# Altium schematic sheet 主控板.SchDoc
size A3
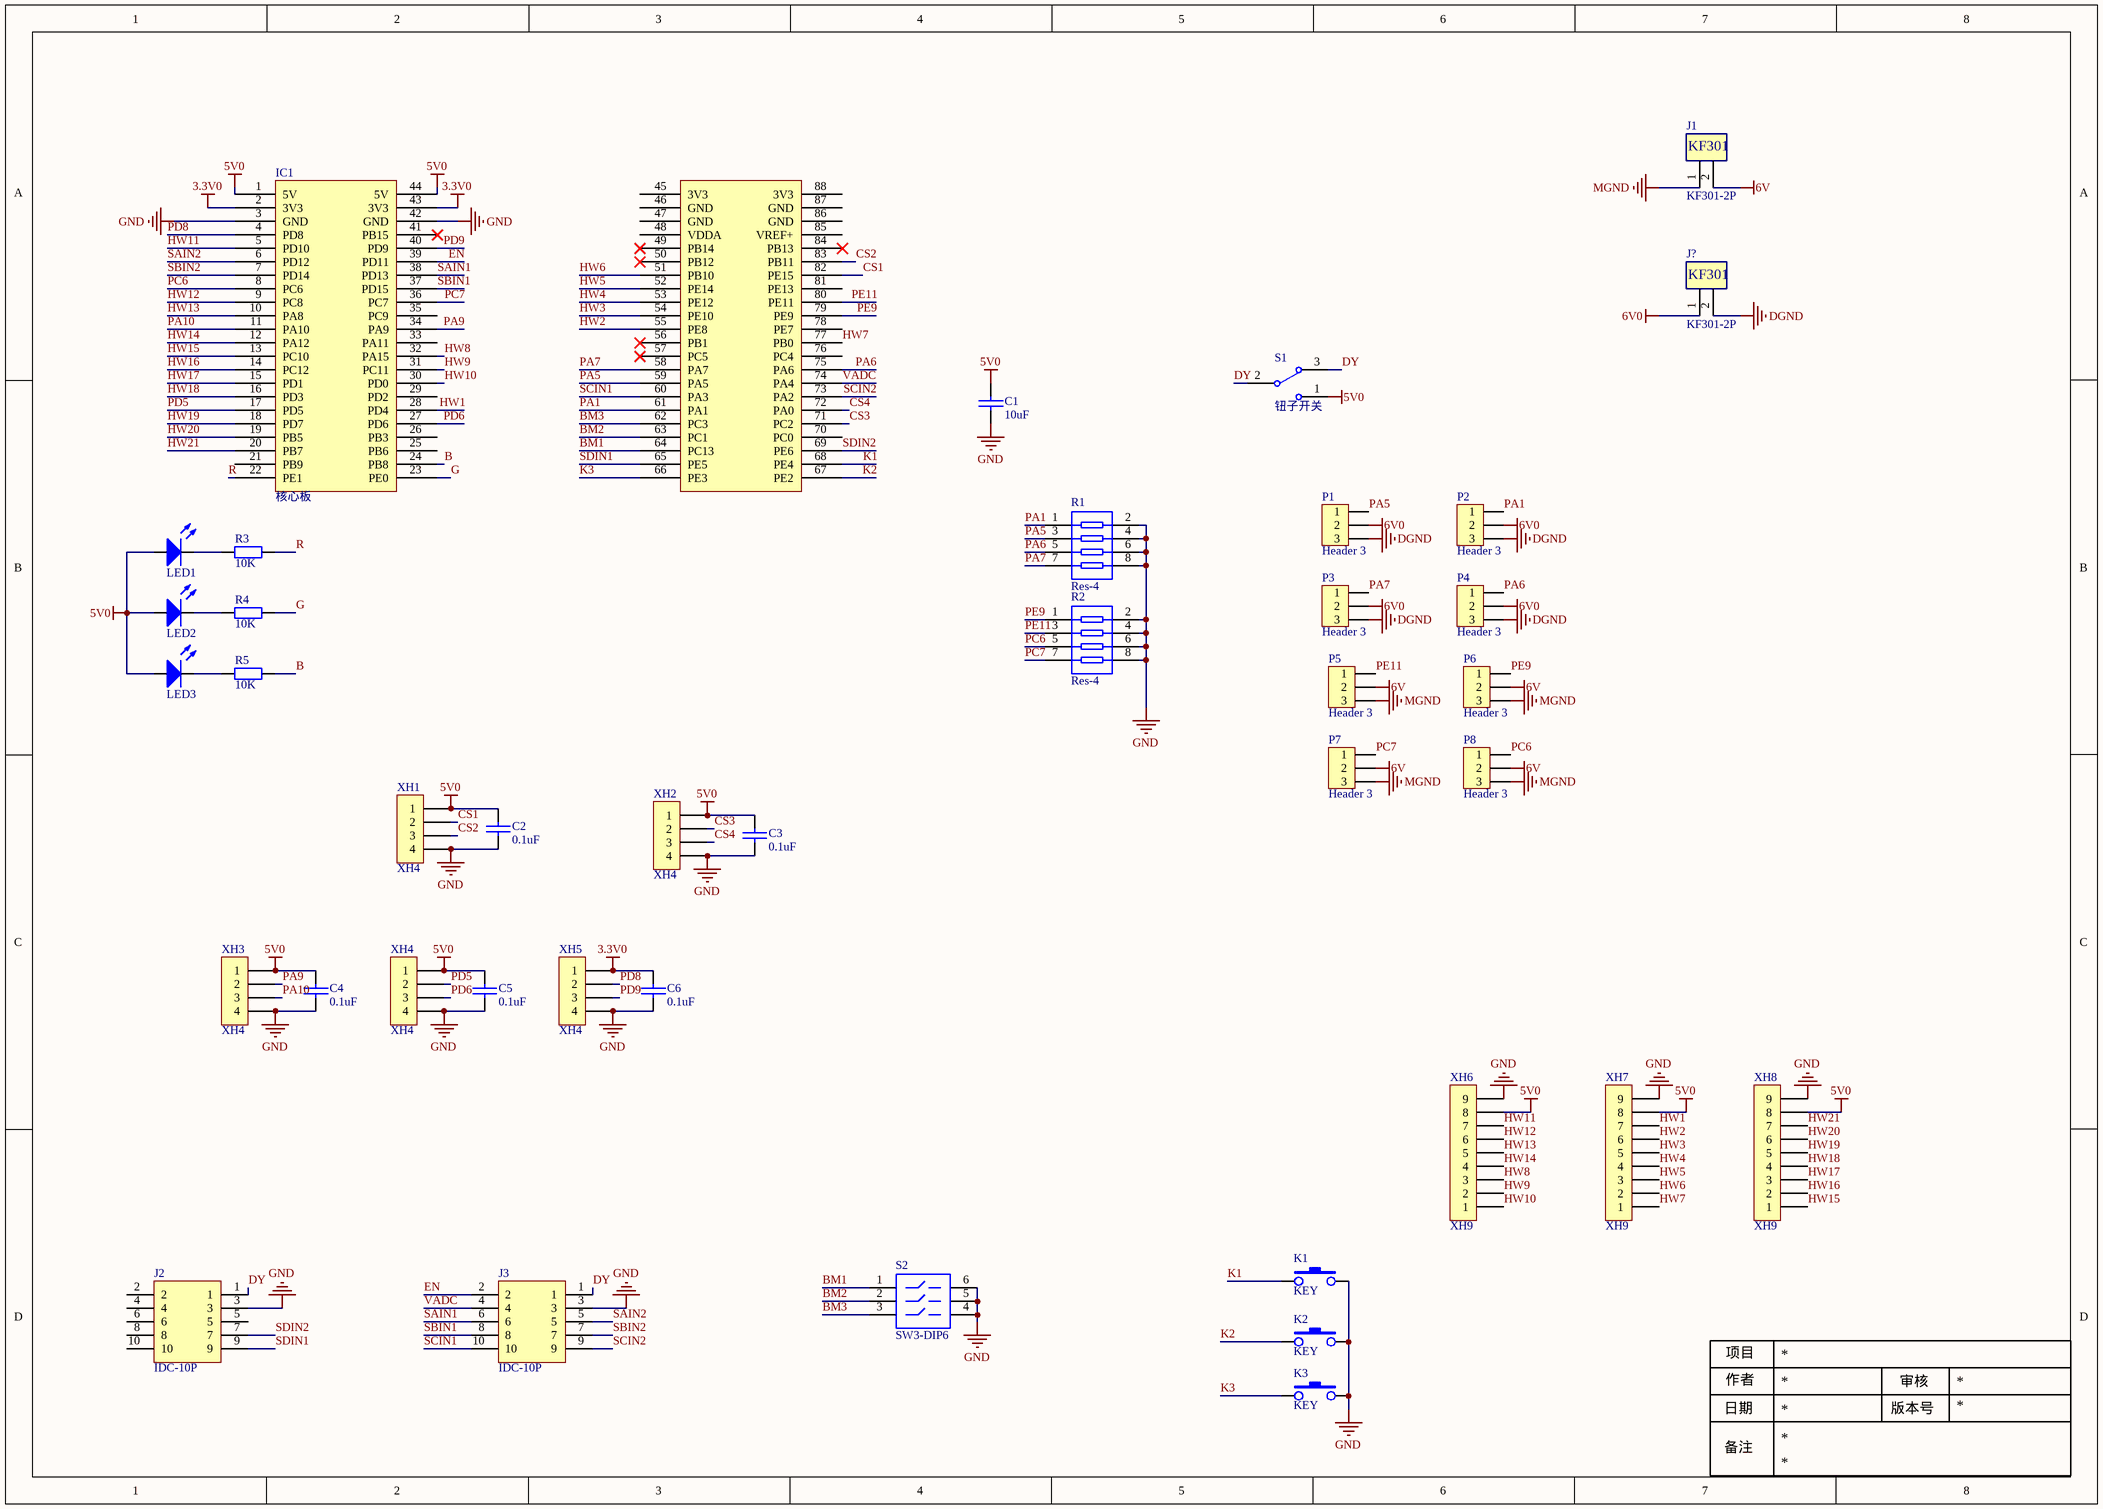
[diagram p0: 主控板.SchDoc]

## Parts
C1  10uF  [0805C]
C2  0.1uF  [0805C]
C3  0.1uF  [0805C]
C4  0.1uF  [0805C]
C5  0.1uF  [0805C]
C6  0.1uF  [0805C]
IC1  核心板  [核心板]
J1  KF301-2P  [KF301-5.0-2P]
J2  IDC-10P  [IDC2.54-10P]
J3  IDC-10P  [IDC2.54-10P]
J?  KF301-2P  [KF301-5.0-2P]
K1  KEY  [SMD-3X6X4.3]
K2  KEY  [SMD-3X6X4.3]
K3  KEY  [SMD-3X6X4.3]
LED1  LED  [LED(0805)]  (value not drawn)
LED2  LED  [LED(0805)]  (value not drawn)
LED3  LED  [LED(0805)]  (value not drawn)
P1  Header 3  [Header 3]
P2  Header 3  [Header 3]
P3  Header 3  [Header 3]
P4  Header 3  [Header 3]
P5  Header 3  [Header 3]
P6  Header 3  [Header 3]
P7  Header 3  [Header 3]
P8  Header 3  [Header 3]
R1  Res-4  [排阻(4位贴片)]
R2  Res-4  [排阻(4位贴片)]
R3  10K  [0805]
R4  10K  [0805]
R5  10K  [0805]
S1  钮子开关  [钮子开关(小)]
S2  SW3-DIP6  [DIP-3P]
XH1  XH4  [XH4/2.54mm/90]
XH2  XH4  [XH4/2.54mm/90]
XH3  XH4  [XH4/2.54mm/90]
XH4  XH4  [XH4/2.54mm/90]
XH5  XH4  [XH4/2.54mm/90]
XH6  XH9  [XH9/2.54mm/90]
XH7  XH9  [XH9/2.54mm/90]
XH8  XH9  [XH9/2.54mm/90]

## Nets
3.3V0: C6.2 IC1.2(3V3) IC1.43(3V3) XH5.1
5V0: C1.2 C2.2 C3.2 C4.2 C5.2 IC1.1(5V) IC1.44(5V) LED1.1(A) LED2.1(A) LED3.1(A) S1.1 XH1.1 XH2.1 XH3.1 XH4.1 XH6.8 XH7.8 XH8.8
6V: J1.2 P5.2 P6.2 P7.2 P8.2
6V0: J?.1 P1.2 P2.2 P3.2 P4.2
DGND: J?.2 P1.3 P2.3 P3.3 P4.3
GND: C1.1 C2.1 C3.1 C4.1 C5.1 C6.1 IC1.3(GND) IC1.42(GND) J2.3 J3.3 K1.3 K2.3 K3.3 R1.2 R1.4 R1.6 R1.8 R2.2 R2.4 R2.6 R2.8 S2.4(B3) S2.5(B2) S2.6(B1) XH1.4 XH2.4 XH3.4 XH4.4 XH5.4 XH6.9 XH7.9 XH8.9
MGND: J1.1 P5.3 P6.3 P7.3 P8.3
B: IC1.24(PB8) R5.2
BM1: IC1.64(PC13) S2.1(A1)
BM2: IC1.63(PC1) S2.2(A2)
BM3: IC1.62(PC3) S2.3(A3)
CS1: IC1.82(PE15) XH1.2
CS2: IC1.83(PB11) XH1.3
CS3: IC1.71(PC2) XH2.2
CS4: IC1.72(PA0) XH2.3
DY: J2.1 J3.1 S1.2 S1.3
EN: IC1.39(PD11) J3.2
G: IC1.23(PE0) R4.2
HW1: IC1.28(PD4) XH7.7
HW2: IC1.55(PE8) XH7.6
HW3: IC1.54(PE10) XH7.5
HW4: IC1.53(PE12) XH7.4
HW5: IC1.52(PE14) XH7.3
HW6: IC1.51(PB10) XH7.2
HW7: IC1.77(PB0) XH7.1
HW8: IC1.32(PA15) XH6.3
HW9: IC1.31(PC11) XH6.2
HW10: IC1.30(PD0) XH6.1
HW11: IC1.5(PD10) XH6.7
HW12: IC1.9(PC8) XH6.6
HW13: IC1.10(PA8) XH6.5
HW14: IC1.12(PA12) XH6.4
HW15: IC1.13(PC10) XH8.1
HW16: IC1.14(PC12) XH8.2
HW17: IC1.15(PD1) XH8.3
HW18: IC1.16(PD3) XH8.4
HW19: IC1.18(PD7) XH8.5
HW20: IC1.19(PB5) XH8.6
HW21: IC1.20(PB7) XH8.7
K1: IC1.68(PE4) K1.1
K2: IC1.67(PE2) K2.1
K3: IC1.66(PE3) K3.1
PA1: IC1.61(PA1) P2.1 R1.1
PA5: IC1.59(PA5) P1.1 R1.3
PA6: IC1.75(PA6) P4.1 R1.5
PA7: IC1.58(PA7) P3.1 R1.7
PA9: IC1.34(PA9) XH3.2
PA10: IC1.11(PA10) XH3.3
PC6: IC1.8(PC6) P8.1 R2.5
PC7: IC1.36(PC7) P7.1 R2.7
PD5: IC1.17(PD5) XH4.2
PD6: IC1.27(PD6) XH4.3
PD8: IC1.4(PD8) XH5.2
PD9: IC1.40(PD9) XH5.3
PE9: IC1.79(PE9) P6.1 R2.1
PE11: IC1.80(PE11) P5.1 R2.3
R: IC1.22(PE1) R3.2
SAIN1: IC1.38(PD13) J3.6
SAIN2: IC1.6(PD12) J3.5
SBIN1: IC1.37(PD15) J3.8
SBIN2: IC1.7(PD14) J3.7
SCIN1: IC1.60(PA3) J3.10
SCIN2: IC1.73(PA2) J3.9
SDIN1: IC1.65(PE5) J2.9
SDIN2: IC1.69(PE6) J2.7
VADC: IC1.74(PA4) J3.4
NetLED1_2: LED1.2(K) R3.1
NetLED2_2: LED2.2(K) R4.1
NetLED3_2: LED3.2(K) R5.1

Not connected (* = marked no-connect by the designer): IC1 21(PB9) 25(PB6) 26(PB3) 29(PD2) 33(PA11) 35(PC9) 41(PB15)* 45(3V3) 46(GND) 47(GND) 48(VDDA) 49(PB14)* 50(PB12)* 56(PB1)* 57(PC5)* 70(PC0) 76(PC4) 78(PE7) 81(PE13) 84(PB13)* 85(VREF+) 86(GND) 87(GND) 88(3V3); J2 2 4 5 6 8 10

## Notes on the sheet
- 项目
- 作者
- 审核
- 日期
- 备注
- 版本号
- (in symbol KF301-2P) KF301

## Library data of the parts
C1-C6 = CAP: 无极性电容
LED1-LED3 = LED: 发光二极管
P1-P8 = Header 3: 排针
R1 R2 = Res-4: 排阻
R3-R5 = Res: 通用电阻; Value: 10K
S1 = 钮子开关: 大功率开关